# Altium project EFR32xG1x_DISC_REF_DES_A00.PrjPcb
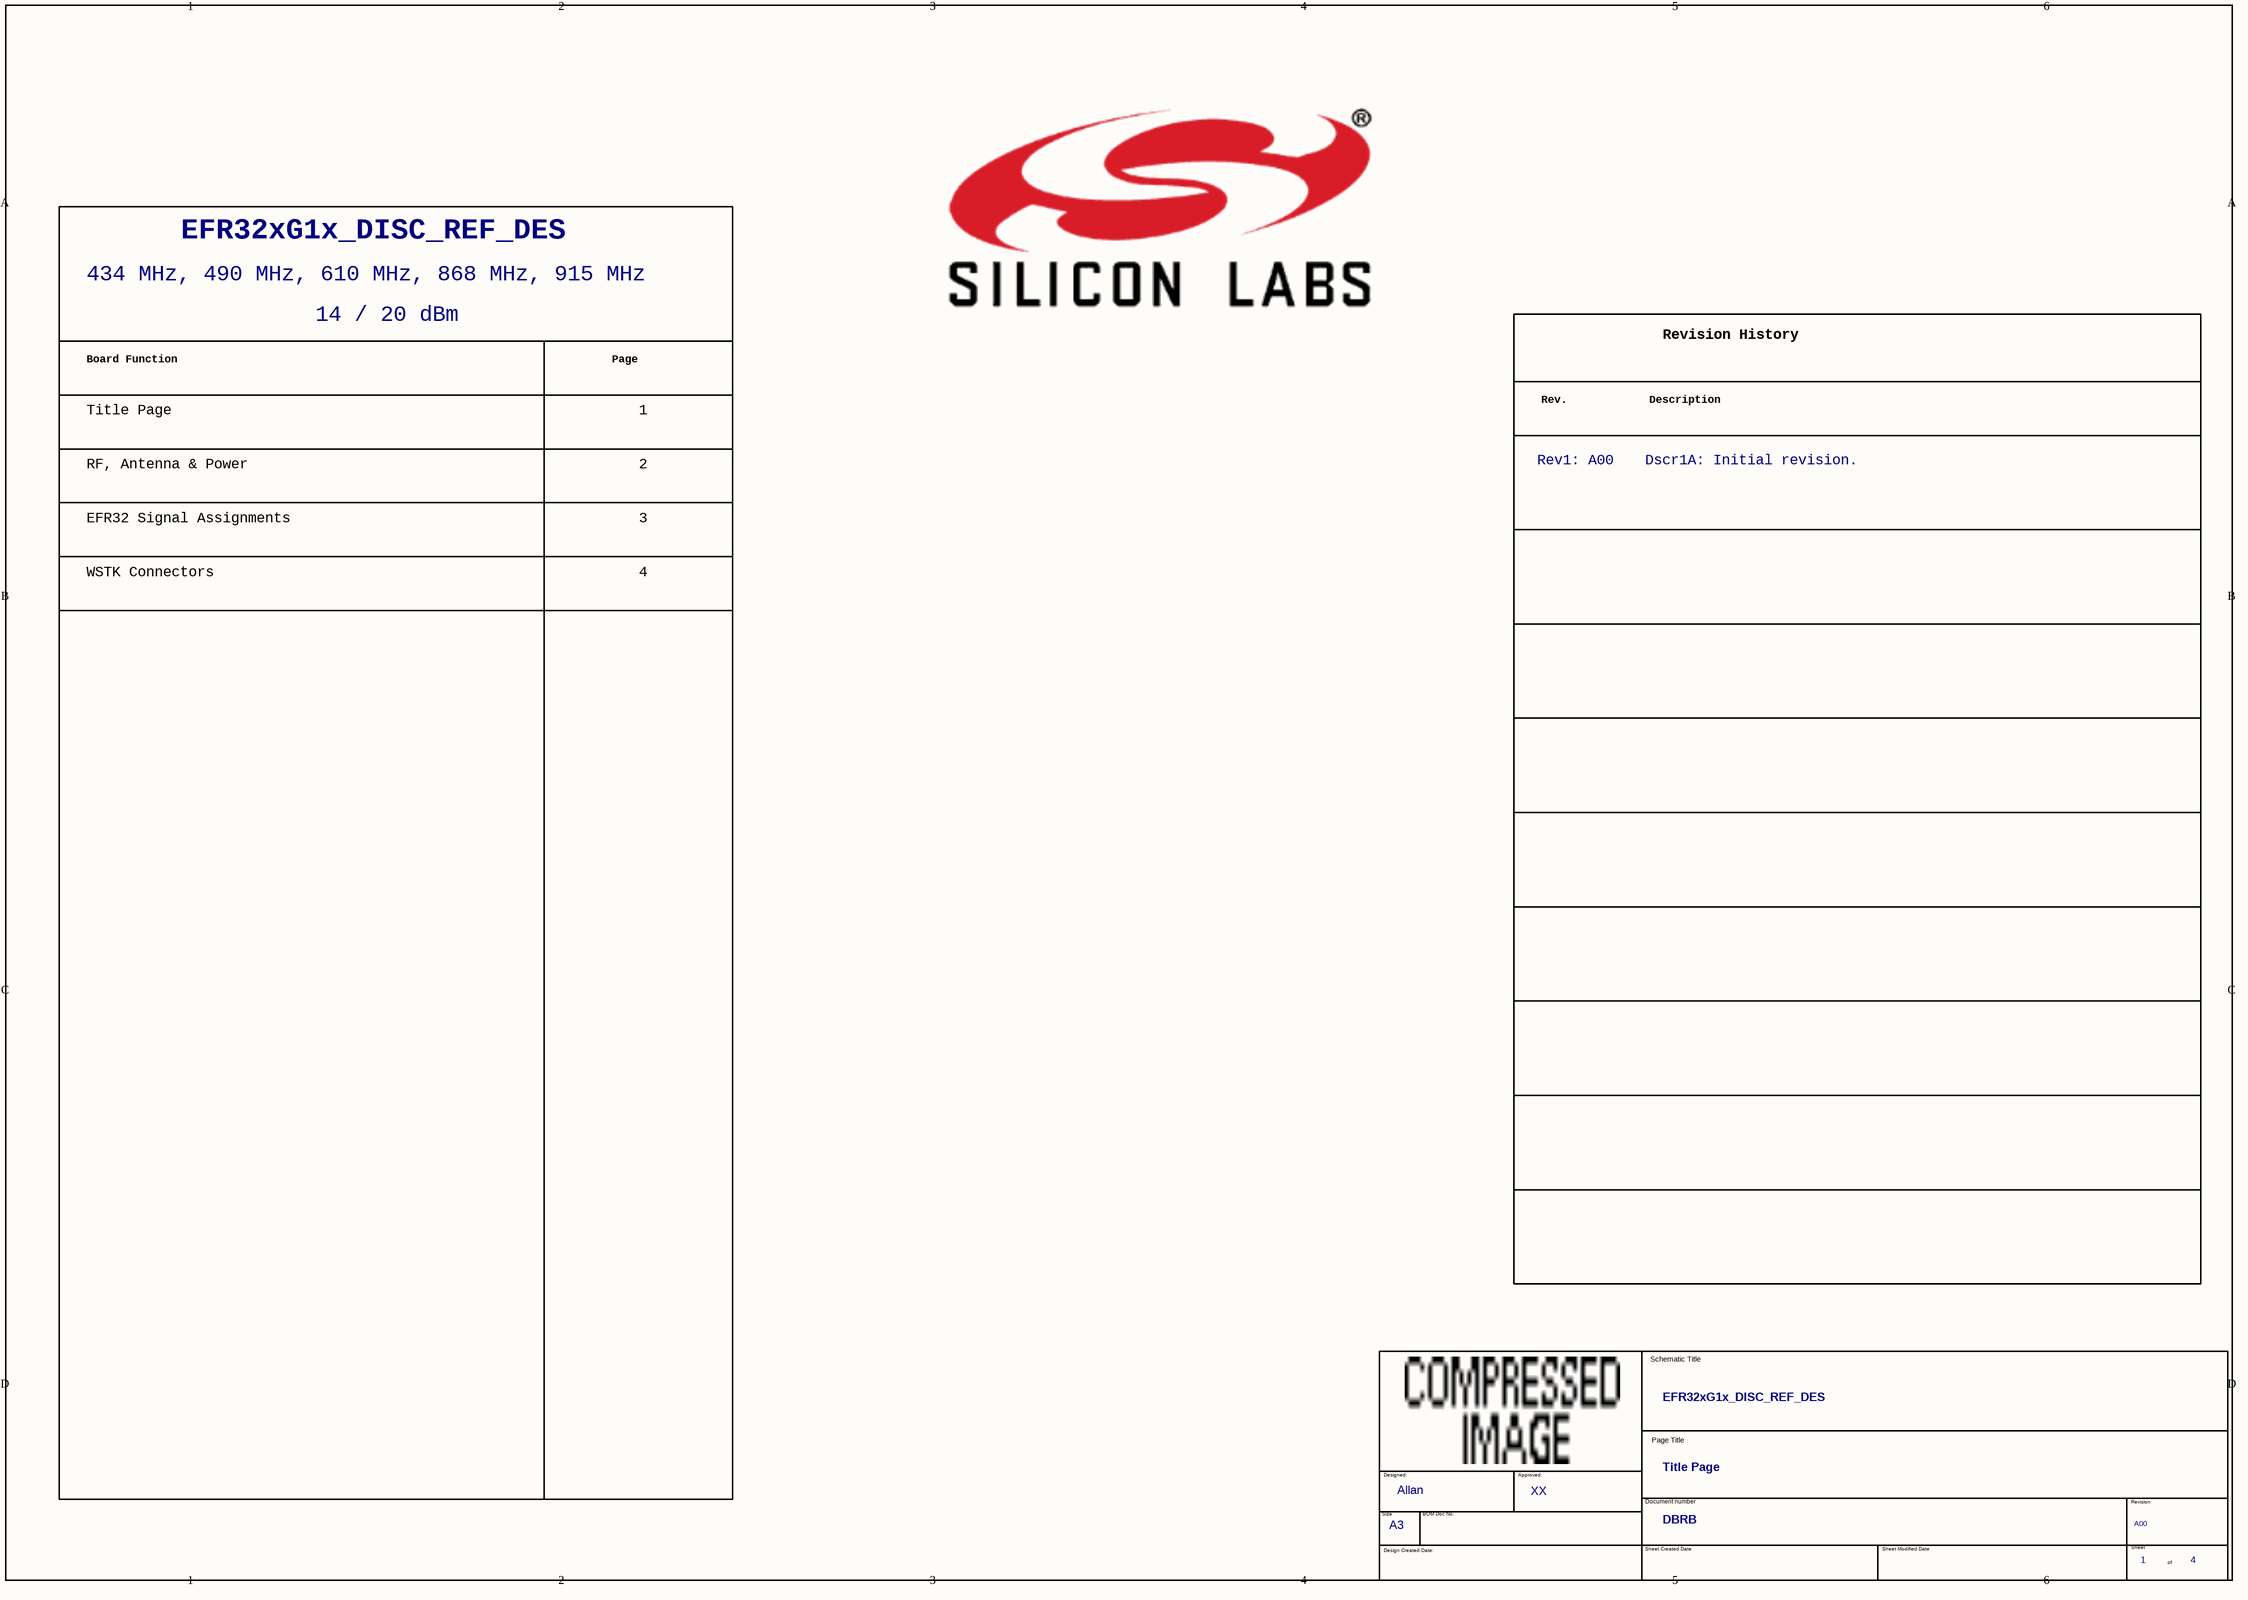
[diagram p0: 01_EFR32xG1x_DISC_REF_DES_A00_TitlePage.SchDoc]
4 sheets, 94 parts. Net scope: global (net labels, ports and power ports of the same name join across sheets).
Board file: EFR32xG1x_DISC_REF_DES_A00.PcbDoc
Sheets:
  01_EFR32xG1x_DISC_REF_DES_A00_TitlePage.SchDoc
  02_EFR32xG1x_DISC_REF_DES_A00_RfAntPower.SchDoc
  03_EFR32xG1x_DISC_REF_DES_A00_Efr32Signal.SchDoc
  04_EFR32xG1x_DISC_REF_DES_A00_Conn.SchDoc

## Sheet 01_EFR32xG1x_DISC_REF_DES_A00_TitlePage.SchDoc
size 420 x 297 mm

### Parts
(Parts that share a designator on the sheet are numbered #1, #2 ... from top to bottom, then left to right.)
*#1  Header A: EFR32xG1x_DISC_REF_DES  (hidden comment: Toc_Header)  (graphical)
*#2  Dscr1A: Initial revision.  Rev1: A00  (hidden comment: Rev_History)  (graphical)
*#3  OrgAddr2: XX  OrgAddr1: Allan  Page Count: 4  Page Number: 1  Doc: DBRB  Title: EFR32xG1x_DISC_REF_DES  RevCode: A00  Page Size: A3  Page Title: Title Page  (hidden comment: TitleBlock_EnergyMicro_A3)  (graphical)

### Notes on the sheet
- 434 MHz, 490 MHz, 610 MHz, 868 MHz, 915 MHz
- 14 / 20 dBm
- Board Function
- Page
- Title Page
- 1
- EFR32 Signal Assignments
- RF, Antenna & Power
- 2
- 3
- WSTK Connectors
- 4
- (in symbol Rev_History) Revision History; Rev.; Description
- (in symbol TitleBlock_EnergyMicro_A3) Schematic Title; Page Title; Designed:; Approved:; Document number; Revision; Size; BOM Doc No:; Design Created Date:; Sheet Created Date; Sheet Modified Date; Sheet; of

### Library data of the parts
*#1 = Toc_Header: Doc: BRD4259A; Page Count: 5; Page Number: 1; OrgName: Silicon Labs; RevCode: A01
*#2 = Rev_History: Doc: BRD4259A; RevCode: A01; Title: EFR32FG14 2.4 GHz / 434 MHz 10 dBm Radio Board; OrgAddr2: JNO; OrgAddr1: JSH; OrgName: Silicon Labs; Page Number: 1; Page Count: 5

## Sheet 02_EFR32xG1x_DISC_REF_DES_A00_RfAntPower.SchDoc
size 420 x 297 mm
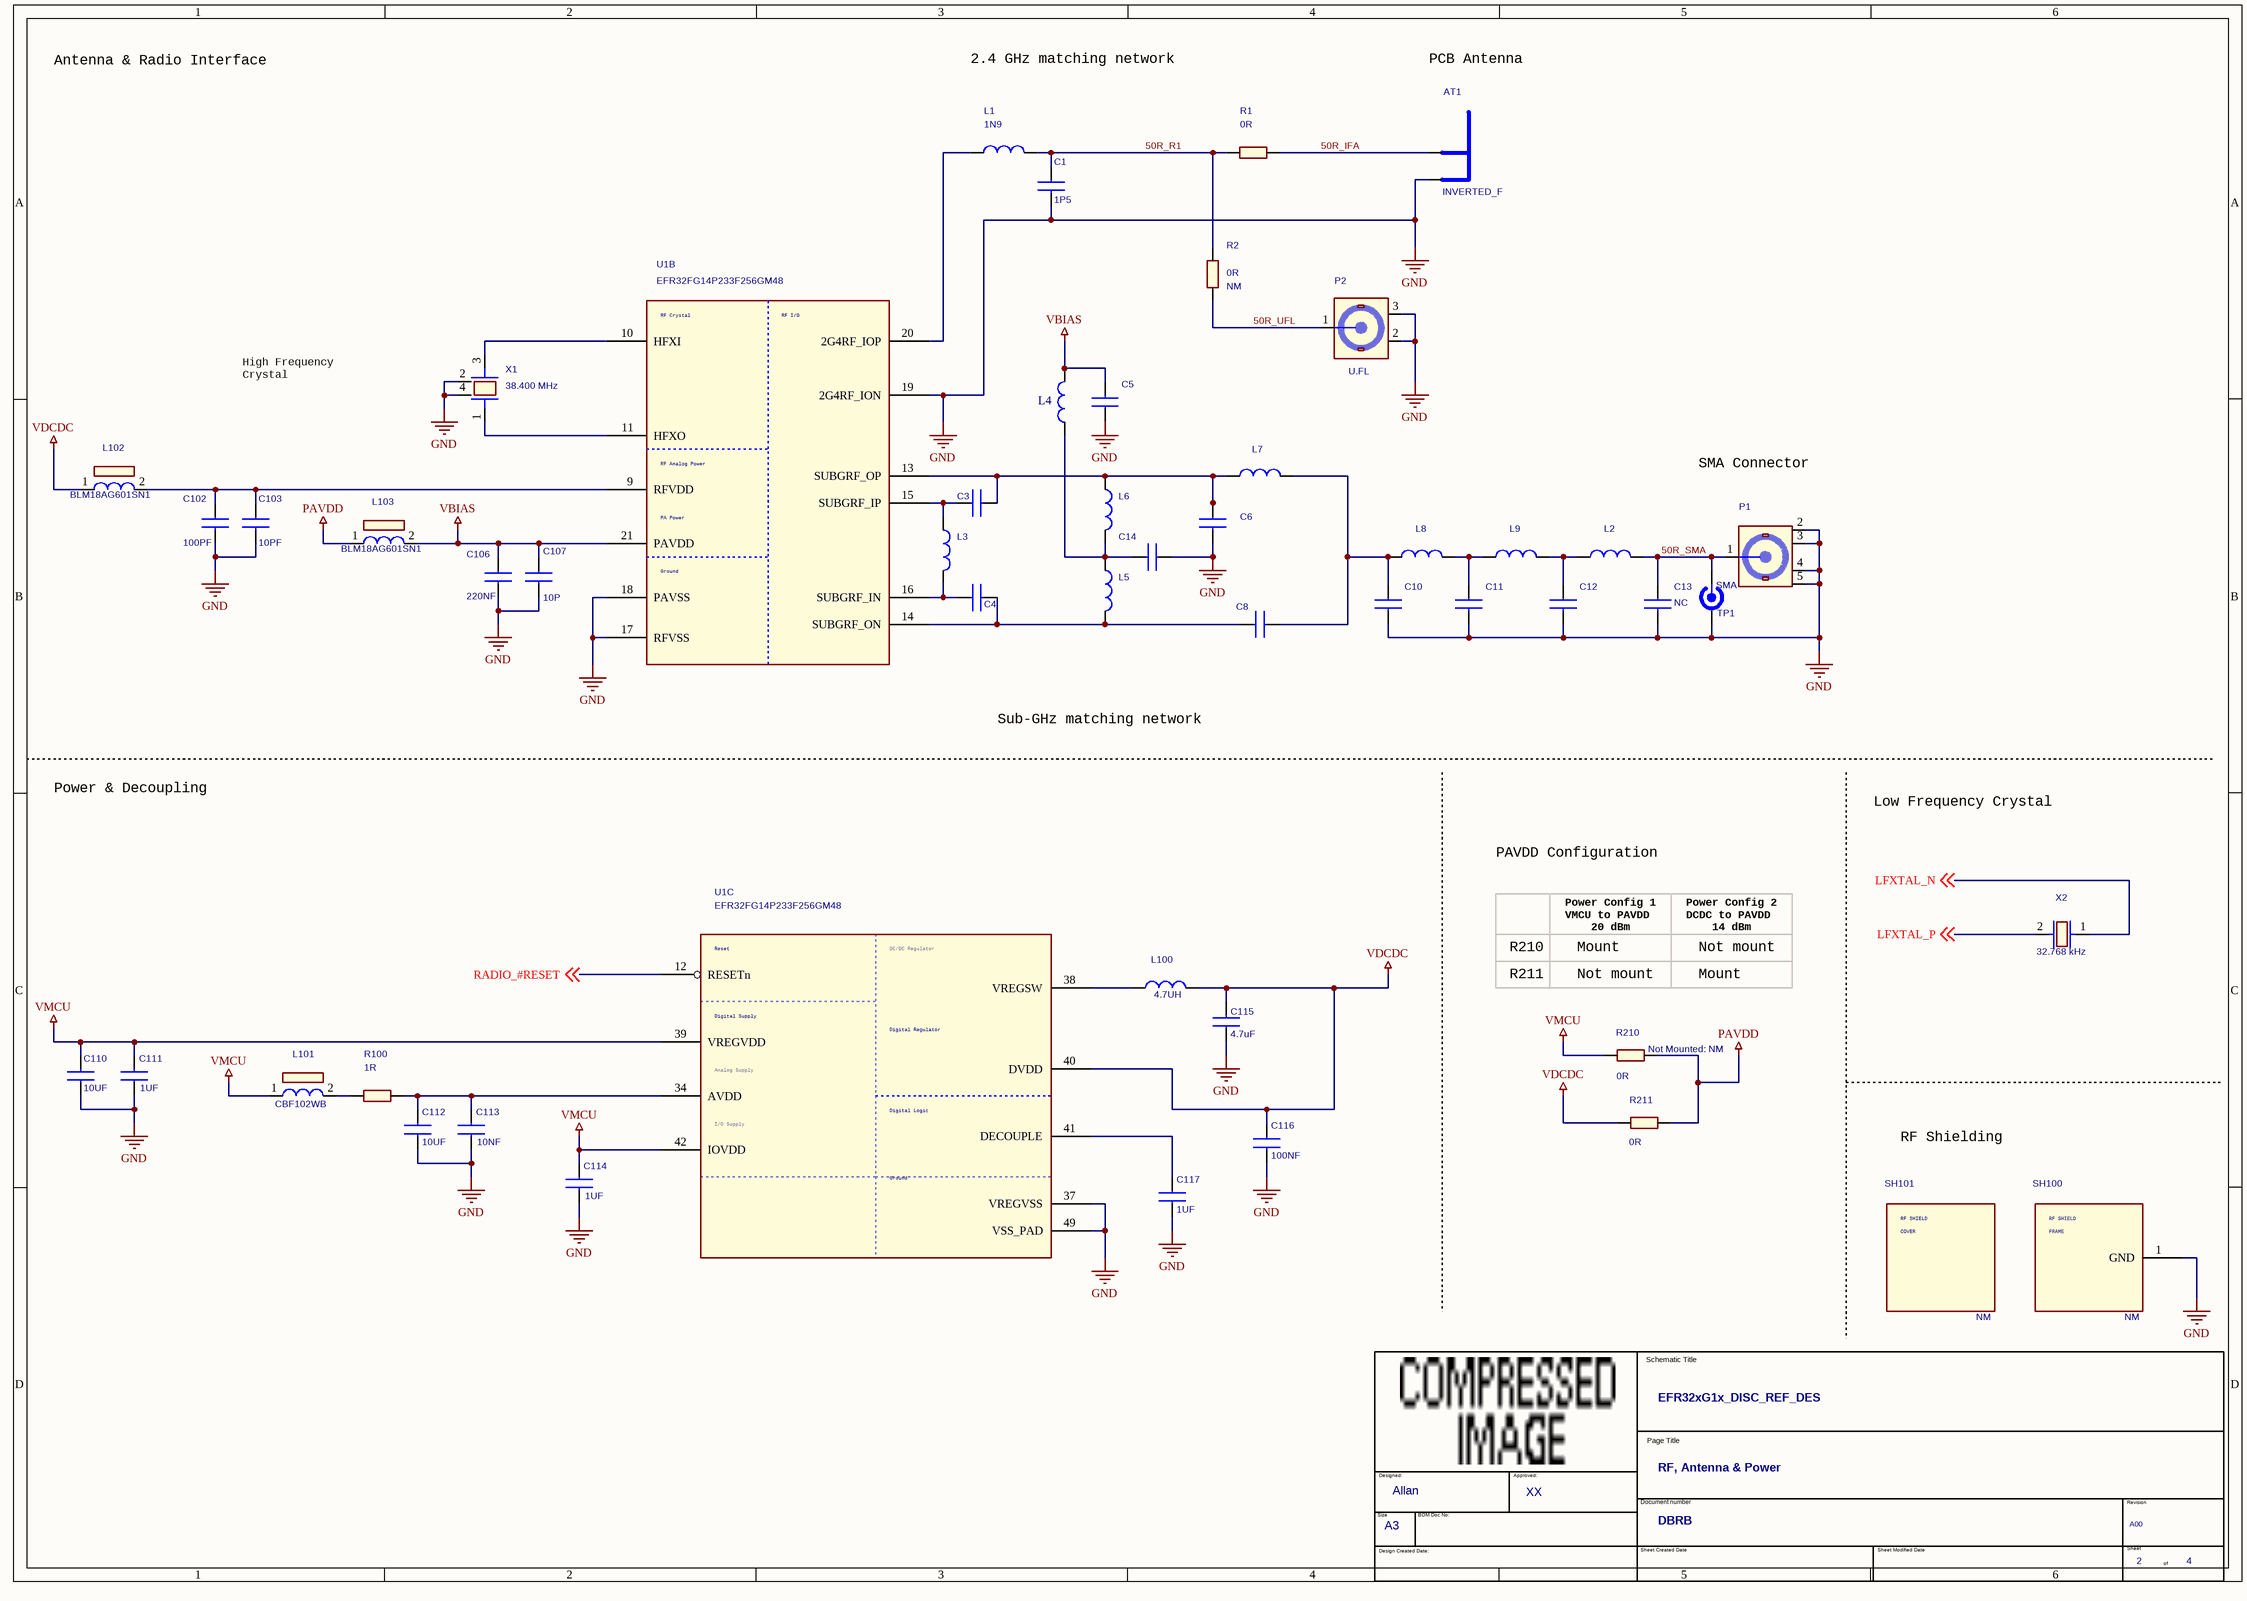
[diagram p1: 02_EFR32xG1x_DISC_REF_DES_A00_RfAntPower.SchDoc]

### Parts
(Parts that share a designator on the sheet are numbered #1, #2 ... from top to bottom, then left to right.)
*#4  OrgAddr2: XX  OrgAddr1: Allan  Page Count: 4  Page Number: 2  Doc: DBRB  Title: EFR32xG1x_DISC_REF_DES  RevCode: A00  Page Size: A3  Page Title: RF, Antenna & Power  (hidden comment: TitleBlock_EnergyMicro_A3)  (graphical)
AT1  INVERTED_F  [ANT_INV_F_2.4_GHZ_17.3MM_MIR]
C1  1P5  [C0201_L]
C3  1P8  [C0201_L]  (value not drawn)
C4  1P8  [C0201_L]  (value not drawn)
C5  270pF  [C0201_L]  (value not drawn)
C6  5.1P  [C0201_L]  (value not drawn)
C8  4P7  [C0201_L]  (value not drawn)
C10  6P2  [C0201_L]  (value not drawn)
C11  5.6P  [C0201_L]  (value not drawn)
C12  5P6  [C0201_L]  (value not drawn)
C13  NC  [C0201_L]
C14  2P  [C0201_L]  (value not drawn)
C102  100PF  [C0402_L]
C103  10PF  [C0402_L]
C106  220NF  [C0402_L]
C107  10P  [C0201_L]
C110  10UF  [C0603_L]
C111  1UF  [C0402_L]
C112  10UF  [C0603_L]
C113  10NF  [C0402_L]
C114  1UF  [C0402_L]
C115  4.7uF  [C0402_L]
C116  100NF  [C0402_L]
C117  1UF  [C0402_L]
L1  1N9  [COIL_0201_L]
L2  120P  [COIL_0201_L]  (value not drawn)
L3  75NH  [COIL_0201_L]  (value not drawn)
L4  330NH  [COIL_0402_L]  (value not drawn)
L5  12NH  [COIL_0201_L]  (value not drawn)
L6  12NH  [COIL_0201_L]  (value not drawn)
L7  27NH  [COIL_0201_L]  (value not drawn)
L8  24NH  [COIL_0201_L]  (value not drawn)
L9  24NH  [COIL_0201_L]  (value not drawn)
L100  4.7UH  [COIL_MUR_LQH3NP_1212]
L101  CBF102WB  [WURTH_CBF_0603]
L102  BLM18AG601SN1  [COIL_MUR_BLM18_0603]
L103  BLM18AG601SN1  [COIL_MUR_BLM18_0603]
P1  SMA  [TE_SMA_TH_1814832]
P2  U.FL  [HIROSE_U.FL-R-SMT-1]
R1  0R  [R0402_L]
R2  0R  Not Mounted: NM  [R0402_L]
R100  1R  [R0402_L]
R210  0R  Not Mounted: NM  [R0402_L]
R211  0R  [R0402_L]
SH100  Not Mounted: NM  [RF_SHIELD_FRAME_BMI-S-203-F_PCB4100]  (hidden comment: RF_SHIELD_FRAME_BMI-S-203-F)
SH101  Not Mounted: NM  (hidden comment: RF_SHIELD_COVER_BMI-S-203-C)
TP1  RF_TEST_POINT  [TP_INGUN_50_OHM_CLOSED openvia]  (value not drawn)
U1  EFR32FG14P233F256GM48  [QFN48_M050_SQ7.0_EP_SL_L]  (parts B,C of 3)
X1  38.400 MHz  [X_SSS_DSX211SH_2.05X1.65-4]
X2  32.768 kHz  [X_MCS_CM8V-T1A]

### Nets
GND: AT1.2(GND) C1.1 C5.2 C6.2 C10.2 C11.2 C12.2 C13.2 C14.2 C102.2 C103.2 C106.2 C107.2 C110.2 C111.2 C112.2 C113.2 C114.2 C115.2 C116.2 C117.2 P1.2(GND1) P1.3(GND2) P1.4(GND3) P1.5(GND4) P2.2(GND1) P2.3(GND4) SH100.1(GND) TP1.2(GND) U1.17(RFVSS) U1.18(PAVSS) U1.19(2G4RF_ION) U1.37(VREGVSS) U1.49(VSS_PAD) X1.2 X1.4
PAVDD: L103.1 R210.1 R211.1
VBIAS: C5.1 C106.1 C107.1 L4.1 L103.2 U1.21(PAVDD)
VDCDC: C115.1 C116.1 L100.2 L102.1 R211.2 U1.40(DVDD)
VMCU: C110.1 C111.1 C114.1 L101.1 R210.2 U1.39(VREGVDD) U1.42(IOVDD)
50R_IFA: AT1.1(ANT) R1.2
50R_R1: C1.2 L1.2 R1.1 R2.1
50R_SMA: C13.1 L2.1 P1.1(SIGNAL) TP1.1(RF)
50R_UFL: P2.1(SIGNAL) R2.2
LFXTAL_N: X2.1 ; off-sheet LFXTAL_N  [project net RADIO_PB15]
LFXTAL_P: X2.2 ; off-sheet LFXTAL_P  [project net RADIO_PB14]
RADIO_#RESET: U1.12(RESETn) ; off-sheet RADIO_#RESET  [project net DEBUG.RESET]
NetC3_1: C3.1 C6.1 L6.1 L7.2 U1.13(SUBGRF_OP)
NetC3_2: C3.2 L3.1 U1.15(SUBGRF_IP)
NetC4_1: C4.1 C8.2 L5.2 U1.14(SUBGRF_ON)
NetC4_2: C4.2 L3.2 U1.16(SUBGRF_IN)
NetC8_1: C8.1 C10.1 L7.1 L8.2
NetC11_1: C11.1 L8.1 L9.2
NetC12_1: C12.1 L2.2 L9.1
NetC14_1: C14.1 L4.2 L5.1 L6.2
NetC102_1: C102.1 C103.1 L102.2 U1.9(RFVDD)
NetC112_1: C112.1 C113.1 R100.2 U1.34(AVDD)
NetC117_1: C117.1 U1.41(DECOUPLE)
NetL1_1: L1.1 U1.20(2G4RF_IOP)
NetL100_1: L100.1 U1.38(VREGSW)
NetL101_2: L101.2 R100.1
NetU1_10: U1.10(HFXI) X1.3
NetU1_11: U1.11(HFXO) X1.1

### Notes on the sheet
- Antenna & Radio Interface
- 2.4 GHz matching network
- PCB Antenna
- High Frequency
  Crystal
- SMA Connector
- Sub-GHz matching network
- Power & Decoupling
- PAVDD Configuration
- Low Frequency Crystal
- Power Config 1
  VMCU to PAVDD
  20 dBm
- Power Config 2
  DCDC to PAVDD
  14 dBm
- R210
- R211
- Not mount
- Mount
- RF Shielding
- (in symbol EFR32-DUALBAND-QFN48, part B) RF Crystal; RF I/O; RF Analog Power; PA Power; Ground
- (in symbol EFR32-DUALBAND-QFN48, part C) Reset; DC/DC Regulator; Digital Supply; Digital Regulator; Analog Supply; Digital Logic; I/O Supply; Ground
- (in symbol RF_SHIELD_COVER_BMI-S-203-C) RF SHIELD; COVER
- (in symbol RF_SHIELD_FRAME_BMI-S-203-F) RF SHIELD; FRAME
- (in symbol TitleBlock_EnergyMicro_A3) Schematic Title; Page Title; Designed:; Approved:; Document number; Revision; Size; BOM Doc No:; Design Created Date:; Sheet Created Date; Sheet Modified Date; Sheet; of

### Library data of the parts
AT1 = ANT_INVERTED_F
C1 = C0402: Tolerance: ?.05P; Mfg: Murata; Mfg #: GRM1555C1H1R5WA01D; Technology: C0G
C3 C4 = C0402: Tolerance: ?.05P; Mfg: Murata; Mfg #: GRM1555C1H1R6WA01D; Technology: C0G
C5 C10 = C0402: Tolerance: ?.1P; Mfg: Murata; Mfg #: GRM1555C1H6R2BA01D; Technology: C0G
C6 = C0402
C8 C14 = C0402: Tolerance: ?%; Mfg: Murata; Mfg #: GRM1555C1H271FA01D; Technology: C0G
C11 = C0402: Tolerance: ?%; Mfg: Murata; Mfg #: GRM1555C1H110GA01D; Technology: C0G
C12 C13 = C0402: Tolerance: ?.05pF; Mfg: Murata; Mfg #: GRM1555C1H5R6WA01D; Technology: C0G
C102 C103 C107 = C0402: Rating: 50V; Tolerance: 5%; Technology: C0G
C106 C113 C116 = C0402: Rating: 16V; Tolerance: 10%; Technology: X7R
C110 C112 = C0603: Rating: 6.3V; Tolerance: 20%; Technology: X5R
C111 C114 C117 = C0402: Rating: 25V; Tolerance: 10%; Technology: X5R
C115 = C0402: Rating: 6.3V; Tolerance: 10%; Technology: X5R
L1 = L0402: Mfg: Murata; Mfg #: LQP15MN1N9W02D; Tolerance: ?.05N
L2 L8 L9 = L0402: Mfg: Murata; Mfg #: LQW15AN24NG00D; Tolerance: ?%
L3 L5 L6 = L0402
L4 = L0603
L7 = L0402: Mfg: Murata; Mfg #: LQW15AN18NG00D; Tolerance: ?%
L100 = LQH3NP: Mfg: Murata; Mfg #: LQH3NPN4R7MM0L
L101 = CBF102WB: Mfg: W黵th Electronics; Mfg #: 74279266; Price_1K: 0.031
L102 L103 = BLM18AG: Mfg: Murata; Mfg #: BLM18AG601SN1D; Price_1K: 0.027
P1 = SMA_TH: Mfg #: 5-1814832-1; Mfg: TE Connectivity; Price_1K: 1.46
P2 = HIROSE_U.FL: Mfg: Hirose; Mfg #: U.FL-R-SMT-1; Price_1K: 0.70
R1 R2 R100 R210 R211 = R0402: Price_1K: 0.005
SH100 = RF_SHIELD_FRAME_BMI-S-203-F: Mfg: Laird Technologies; Price_1k: 1.148; Mfg #: BMI-S-203-F; Footprint: Laird_BMI-S-203-F
SH101 = RF_SHIELD_COVER_BMI-S-203-C: Mfg: Laird Technologies; Mfg #: BMI-S-203-C; Price_1k: 0.814
TP1 = TP_RF
U1 = EFR32-DUALBAND-QFN48: MFG: Silicon Labs; MFG #: EFR32FG14P233F256GM48-BR
X1 = DSX211SH: Mfg: KDS; Mfg #: DSX211SH 1ZZNAE38400AB0A; Price_1K: 0.512
X2 = CM8V-T1A: Mfg: KDS; Mfg #: DST210 1TJG125DP1A0012; Price_1K: 0.3

## Sheet 03_EFR32xG1x_DISC_REF_DES_A00_Efr32Signal.SchDoc
size 420 x 297 mm
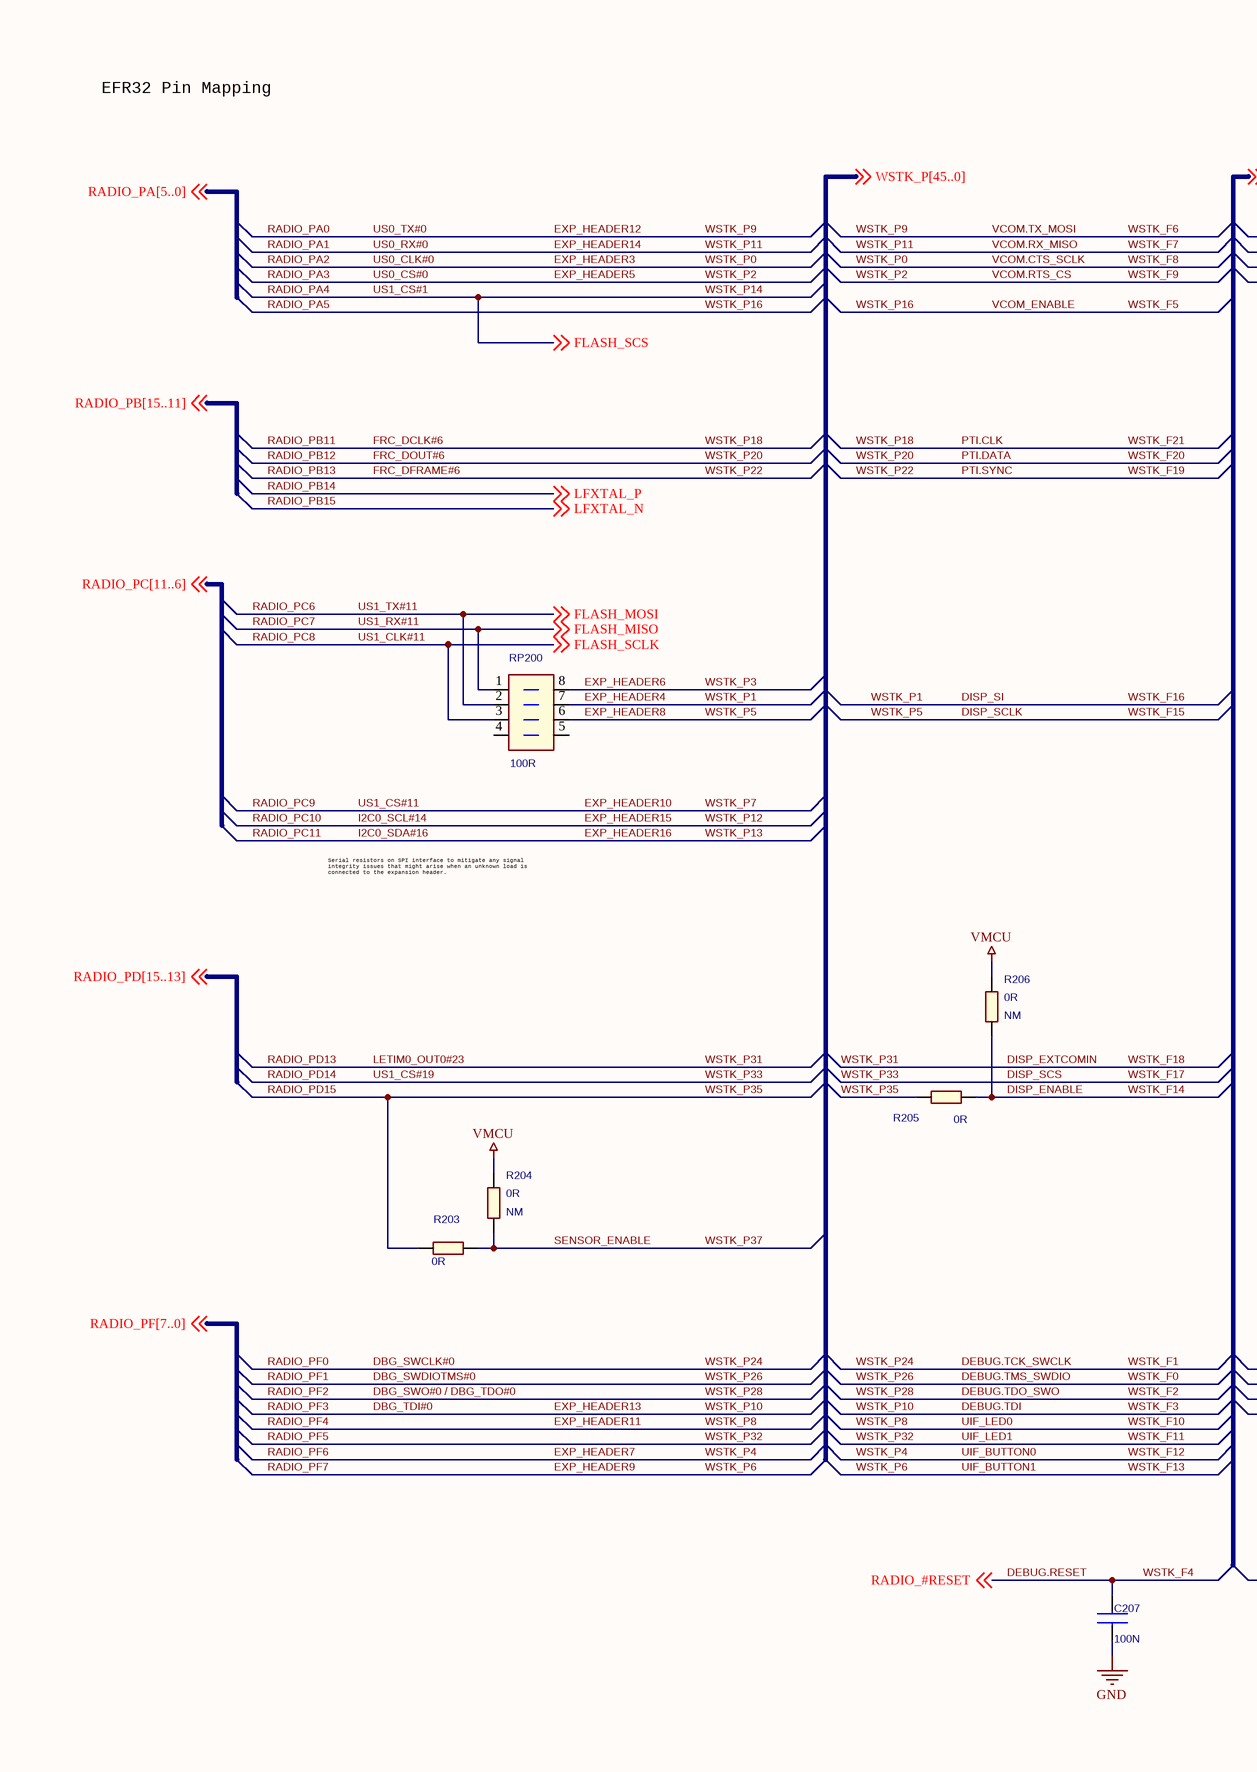
[diagram p2: 03_EFR32xG1x_DISC_REF_DES_A00_Efr32Signal.SchDoc, left]
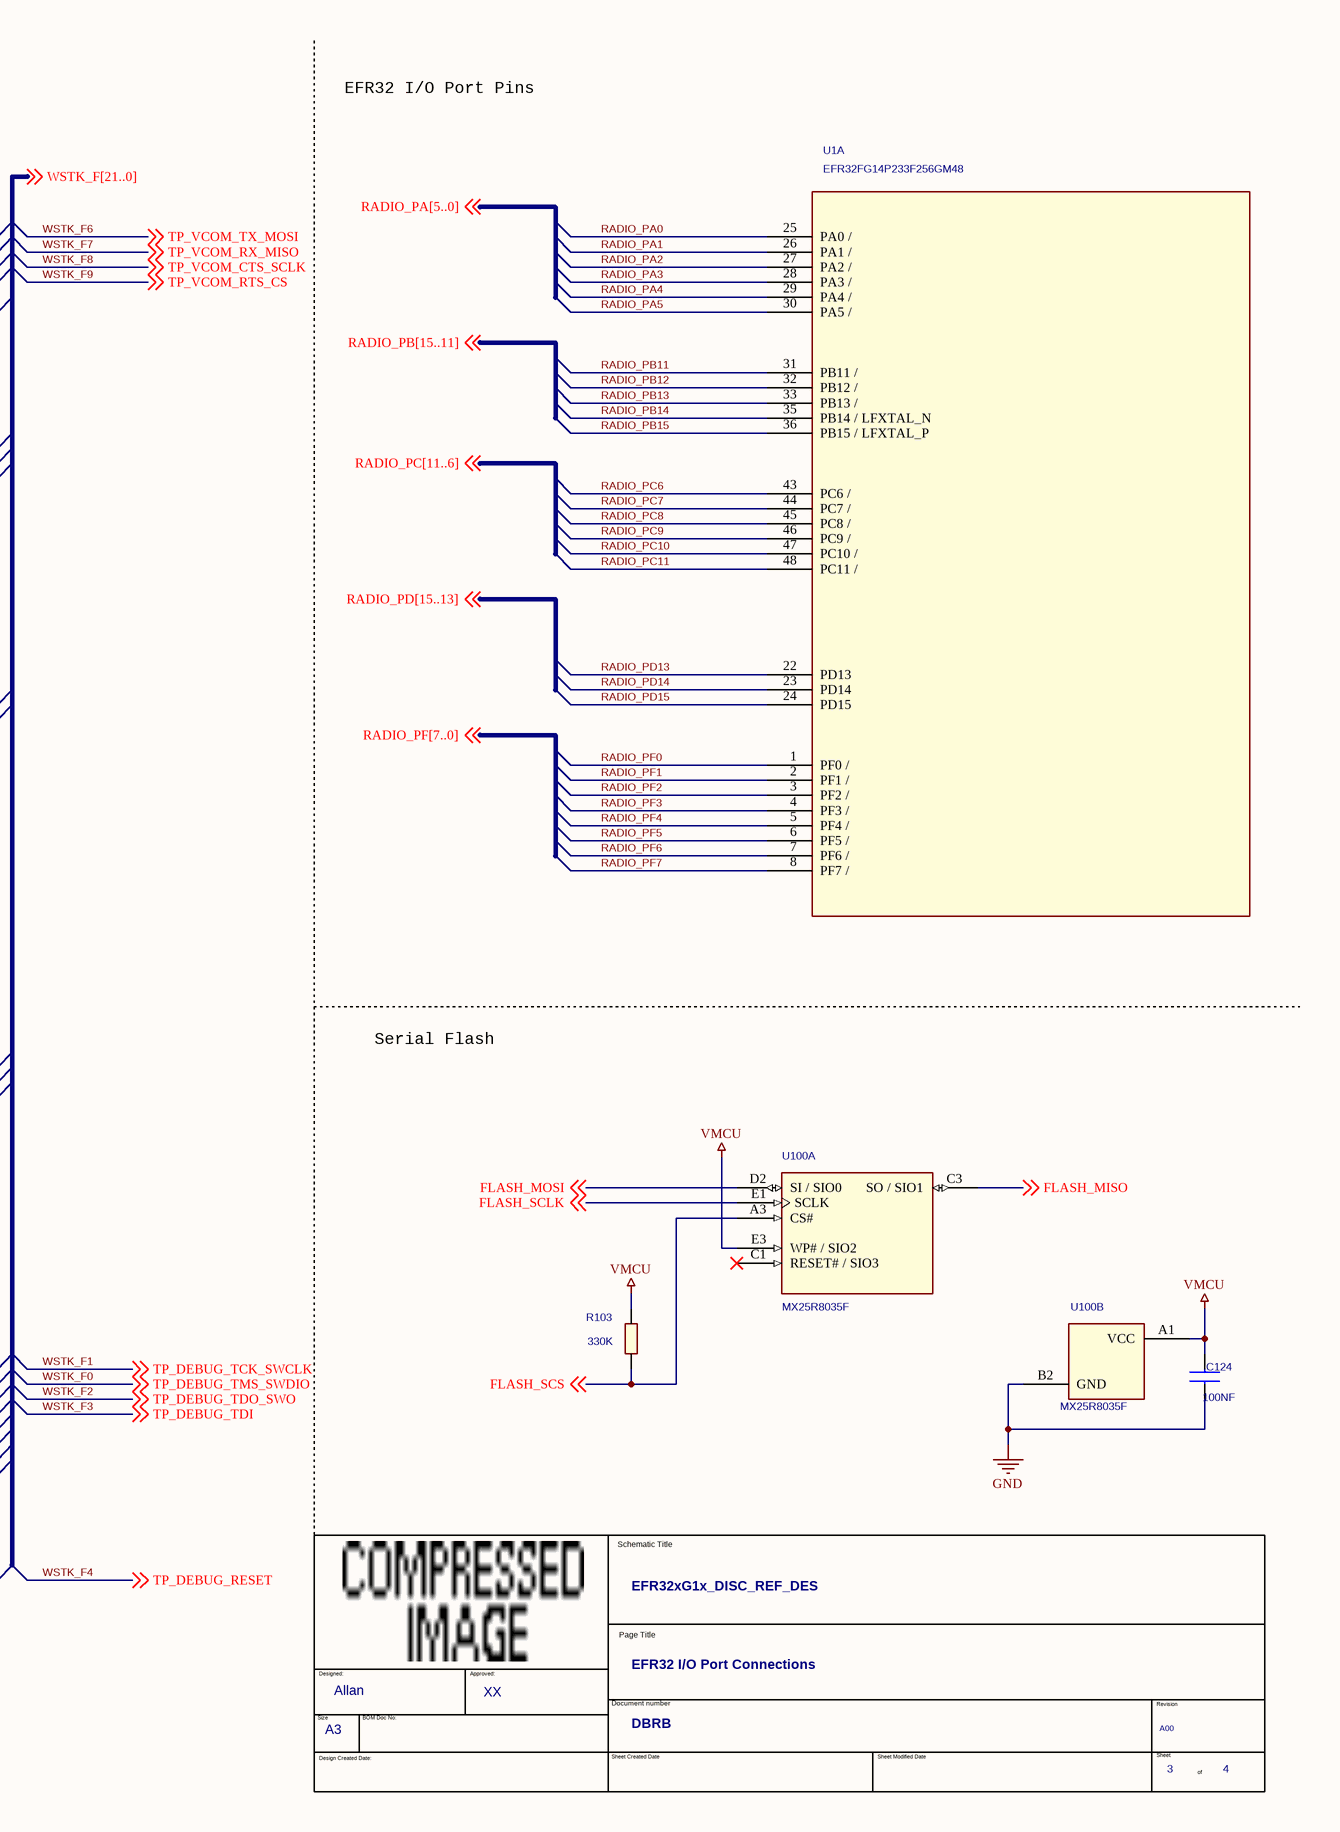
[diagram p3: 03_EFR32xG1x_DISC_REF_DES_A00_Efr32Signal.SchDoc, right]

### Parts
(Parts that share a designator on the sheet are numbered #1, #2 ... from top to bottom, then left to right.)
*#5  OrgAddr2: XX  OrgAddr1: Allan  Page Count: 4  Page Number: 3  Doc: DBRB  Title: EFR32xG1x_DISC_REF_DES  RevCode: A00  Page Size: A3  Page Title: EFR32 I/O Port Connections  (hidden comment: TitleBlock_EnergyMicro_A3)  (graphical)
C124  100NF  [C0402_L]
C207  100N  [C0402_L]
R103  330K  [R0402_L]
R203  0R  [R0402_L]
R204  0R  Not Mounted: NM  [R0402_L]
R205  0R  [R0402_L]
R206  0R  Not Mounted: NM  [R0402_L]
RP200  100R  [RES_MNR04-8]
U1  EFR32FG14P233F256GM48  [QFN48_M050_SQ7.0_EP_SL_L]  (part A of 3)
U100  MX25R8035F  [BGA8_M040_1.24x1.75_WLCSP]  (parts A,B of 2)

### Nets
GND: C124.2 C207.2 U100.B2(GND)
VMCU: C124.1 R103.1 R204.1 R206.1 U100.A1(VCC) U100.E3(WP#_/_SIO2)
DBG_SWCLK#0: U1.1(PF0_/) ; off-sheet TP_DEBUG_TCK_SWCLK  [also labelled DEBUG.TCK_SWCLK, RADIO_PF0, TP_DEBUG_TCK_SWCLK, WSTK_F1, WSTK_P24]
DBG_SWDIOTMS#0: U1.2(PF1_/) ; off-sheet TP_DEBUG_TMS_SWDIO  [also labelled DEBUG.TMS_SWDIO, RADIO_PF1, TP_DEBUG_TMS_SWDIO, WSTK_F0, WSTK_P26]
DBG_SWO#0 / DBG_TDO#0: U1.3(PF2_/) ; off-sheet TP_DEBUG_TDO_SWO  [also labelled DEBUG.TDO_SWO, RADIO_PF2, TP_DEBUG_TDO_SWO, WSTK_F2, WSTK_P28]
DBG_TDI#0: U1.4(PF3_/) ; off-sheet TP_DEBUG_TDI  [also labelled DEBUG.TDI, EXP_HEADER13, RADIO_PF3, TP_DEBUG_TDI, WSTK_F3, WSTK_P10]
DEBUG.RESET: C207.1 ; off-sheet RADIO_#RESET, off-sheet TP_DEBUG_RESET  [also labelled RADIO_#RESET, TP_DEBUG_RESET, WSTK_F4]
DISP_ENABLE: R205.2 R206.2  [also labelled WSTK_F14]
DISP_EXTCOMIN: U1.22(PD13)  [also labelled LETIM0_OUT0#23, RADIO_PD13, WSTK_F18, WSTK_P31]
DISP_SCLK: RP200.6(R16)  [also labelled EXP_HEADER8, WSTK_F15, WSTK_P5]
DISP_SCS: U1.23(PD14)  [also labelled RADIO_PD14, US1_CS#19, WSTK_F17, WSTK_P33]
DISP_SI: RP200.7(R17)  [also labelled EXP_HEADER4, WSTK_F16, WSTK_P1]
EXP_HEADER3: U1.27(PA2_/) ; off-sheet TP_VCOM_CTS_SCLK  [also labelled RADIO_PA2, TP_VCOM_CTS_SCLK, US0_CLK#0, VCOM.CTS_SCLK, WSTK_F8, WSTK_P0]
EXP_HEADER5: U1.28(PA3_/) ; off-sheet TP_VCOM_RTS_CS  [also labelled RADIO_PA3, TP_VCOM_RTS_CS, US0_CS#0, VCOM.RTS_CS, WSTK_F9, WSTK_P2]
EXP_HEADER6: RP200.8(R18)  [also labelled WSTK_P3]
EXP_HEADER7: U1.7(PF6_/)  [also labelled RADIO_PF6, UIF_BUTTON0, WSTK_F12, WSTK_P4]
EXP_HEADER9: U1.8(PF7_/)  [also labelled RADIO_PF7, UIF_BUTTON1, WSTK_F13, WSTK_P6]
EXP_HEADER10: U1.46(PC9_/)  [also labelled RADIO_PC9, US1_CS#11, WSTK_P7]
EXP_HEADER11: U1.5(PF4_/)  [also labelled RADIO_PF4, UIF_LED0, WSTK_F10, WSTK_P8]
EXP_HEADER12: U1.25(PA0_/) ; off-sheet TP_VCOM_TX_MOSI  [also labelled RADIO_PA0, TP_VCOM_TX_MOSI, US0_TX#0, VCOM.TX_MOSI, WSTK_F6, WSTK_P9]
EXP_HEADER14: U1.26(PA1_/) ; off-sheet TP_VCOM_RX_MISO  [also labelled RADIO_PA1, TP_VCOM_RX_MISO, US0_RX#0, VCOM.RX_MISO, WSTK_F7, WSTK_P11]
EXP_HEADER15: U1.47(PC10_/)  [also labelled I2C0_SCL#14, RADIO_PC10, WSTK_P12]
EXP_HEADER16: U1.48(PC11_/)  [also labelled I2C0_SDA#16, RADIO_PC11, WSTK_P13]
FRC_DCLK#6: U1.31(PB11_/)  [also labelled PTI.CLK, RADIO_PB11, WSTK_F21, WSTK_P18]
FRC_DFRAME#6: U1.33(PB13_/)  [also labelled PTI.SYNC, RADIO_PB13, WSTK_F19, WSTK_P22]
FRC_DOUT#6: U1.32(PB12_/)  [also labelled PTI.DATA, RADIO_PB12, WSTK_F20, WSTK_P20]
RADIO_PA4: R103.2 U1.29(PA4_/) U100.A3(CS#) ; off-sheet FLASH_SCS  [also labelled FLASH_SCS, US1_CS#1, WSTK_P14]
RADIO_PA5: U1.30(PA5_/)  [also labelled VCOM_ENABLE, WSTK_F5, WSTK_P16]
RADIO_PB14: U1.35(PB14_/_LFXTAL_N) ; off-sheet LFXTAL_P  [also labelled LFXTAL_P]
RADIO_PB15: U1.36(PB15_/_LFXTAL_P) ; off-sheet LFXTAL_N  [also labelled LFXTAL_N]
RADIO_PC6: RP200.2(R12) U1.43(PC6_/) U100.D2(SI_/_SIO0) ; off-sheet FLASH_MOSI  [also labelled FLASH_MOSI, US1_TX#11]
RADIO_PC7: RP200.1(R11) U1.44(PC7_/) U100.C3(SO_/_SIO1) ; off-sheet FLASH_MISO  [also labelled FLASH_MISO, US1_RX#11]
RADIO_PC8: RP200.3(R13) U1.45(PC8_/) U100.E1(SCLK) ; off-sheet FLASH_SCLK  [also labelled FLASH_SCLK, US1_CLK#11]
RADIO_PD15: R203.1 R205.1 U1.24(PD15)  [also labelled WSTK_P35]
RADIO_PF5: U1.6(PF5_/)  [also labelled UIF_LED1, WSTK_F11, WSTK_P32]
SENSOR_ENABLE: R203.2 R204.2  [also labelled WSTK_P37]

Not connected (* = marked no-connect by the designer): RP200 4(R14) 5(R15); U100 C1(RESET#_/_SIO3)*

### Notes on the sheet
- EFR32 Pin Mapping
- EFR32 I/O Port Pins
- Serial resistors on SPI interface to mitigate any signal
  integrity issues that might arise when an unknown load is
  connected to the expansion header.
- Serial Flash
- (in symbol TitleBlock_EnergyMicro_A3) Schematic Title; Page Title; Designed:; Approved:; Document number; Revision; Size; BOM Doc No:; Design Created Date:; Sheet Created Date; Sheet Modified Date; Sheet; of

### Library data of the parts
C124 C207 = C0402: Rating: 16V; Tolerance: 10%; Technology: X7R
R103 R203-R206 = R0402: Price_1K: 0.005
RP200 = MNR04M0APJ101: Mfg: ROHM; Mfg #: MNR04M0APJ101; Price_1K: 0.0122
U1 = EFR32-DUALBAND-QFN48: as U1 on sheet 02_EFR32xG1x_DISC_REF_DES_A00_RfAntPower
U100 = MX25R8035: Mfg: Macronix; Mfg #: MX25R8035FBDIL0

## Sheet 04_EFR32xG1x_DISC_REF_DES_A00_Conn.SchDoc
size 420 x 297 mm
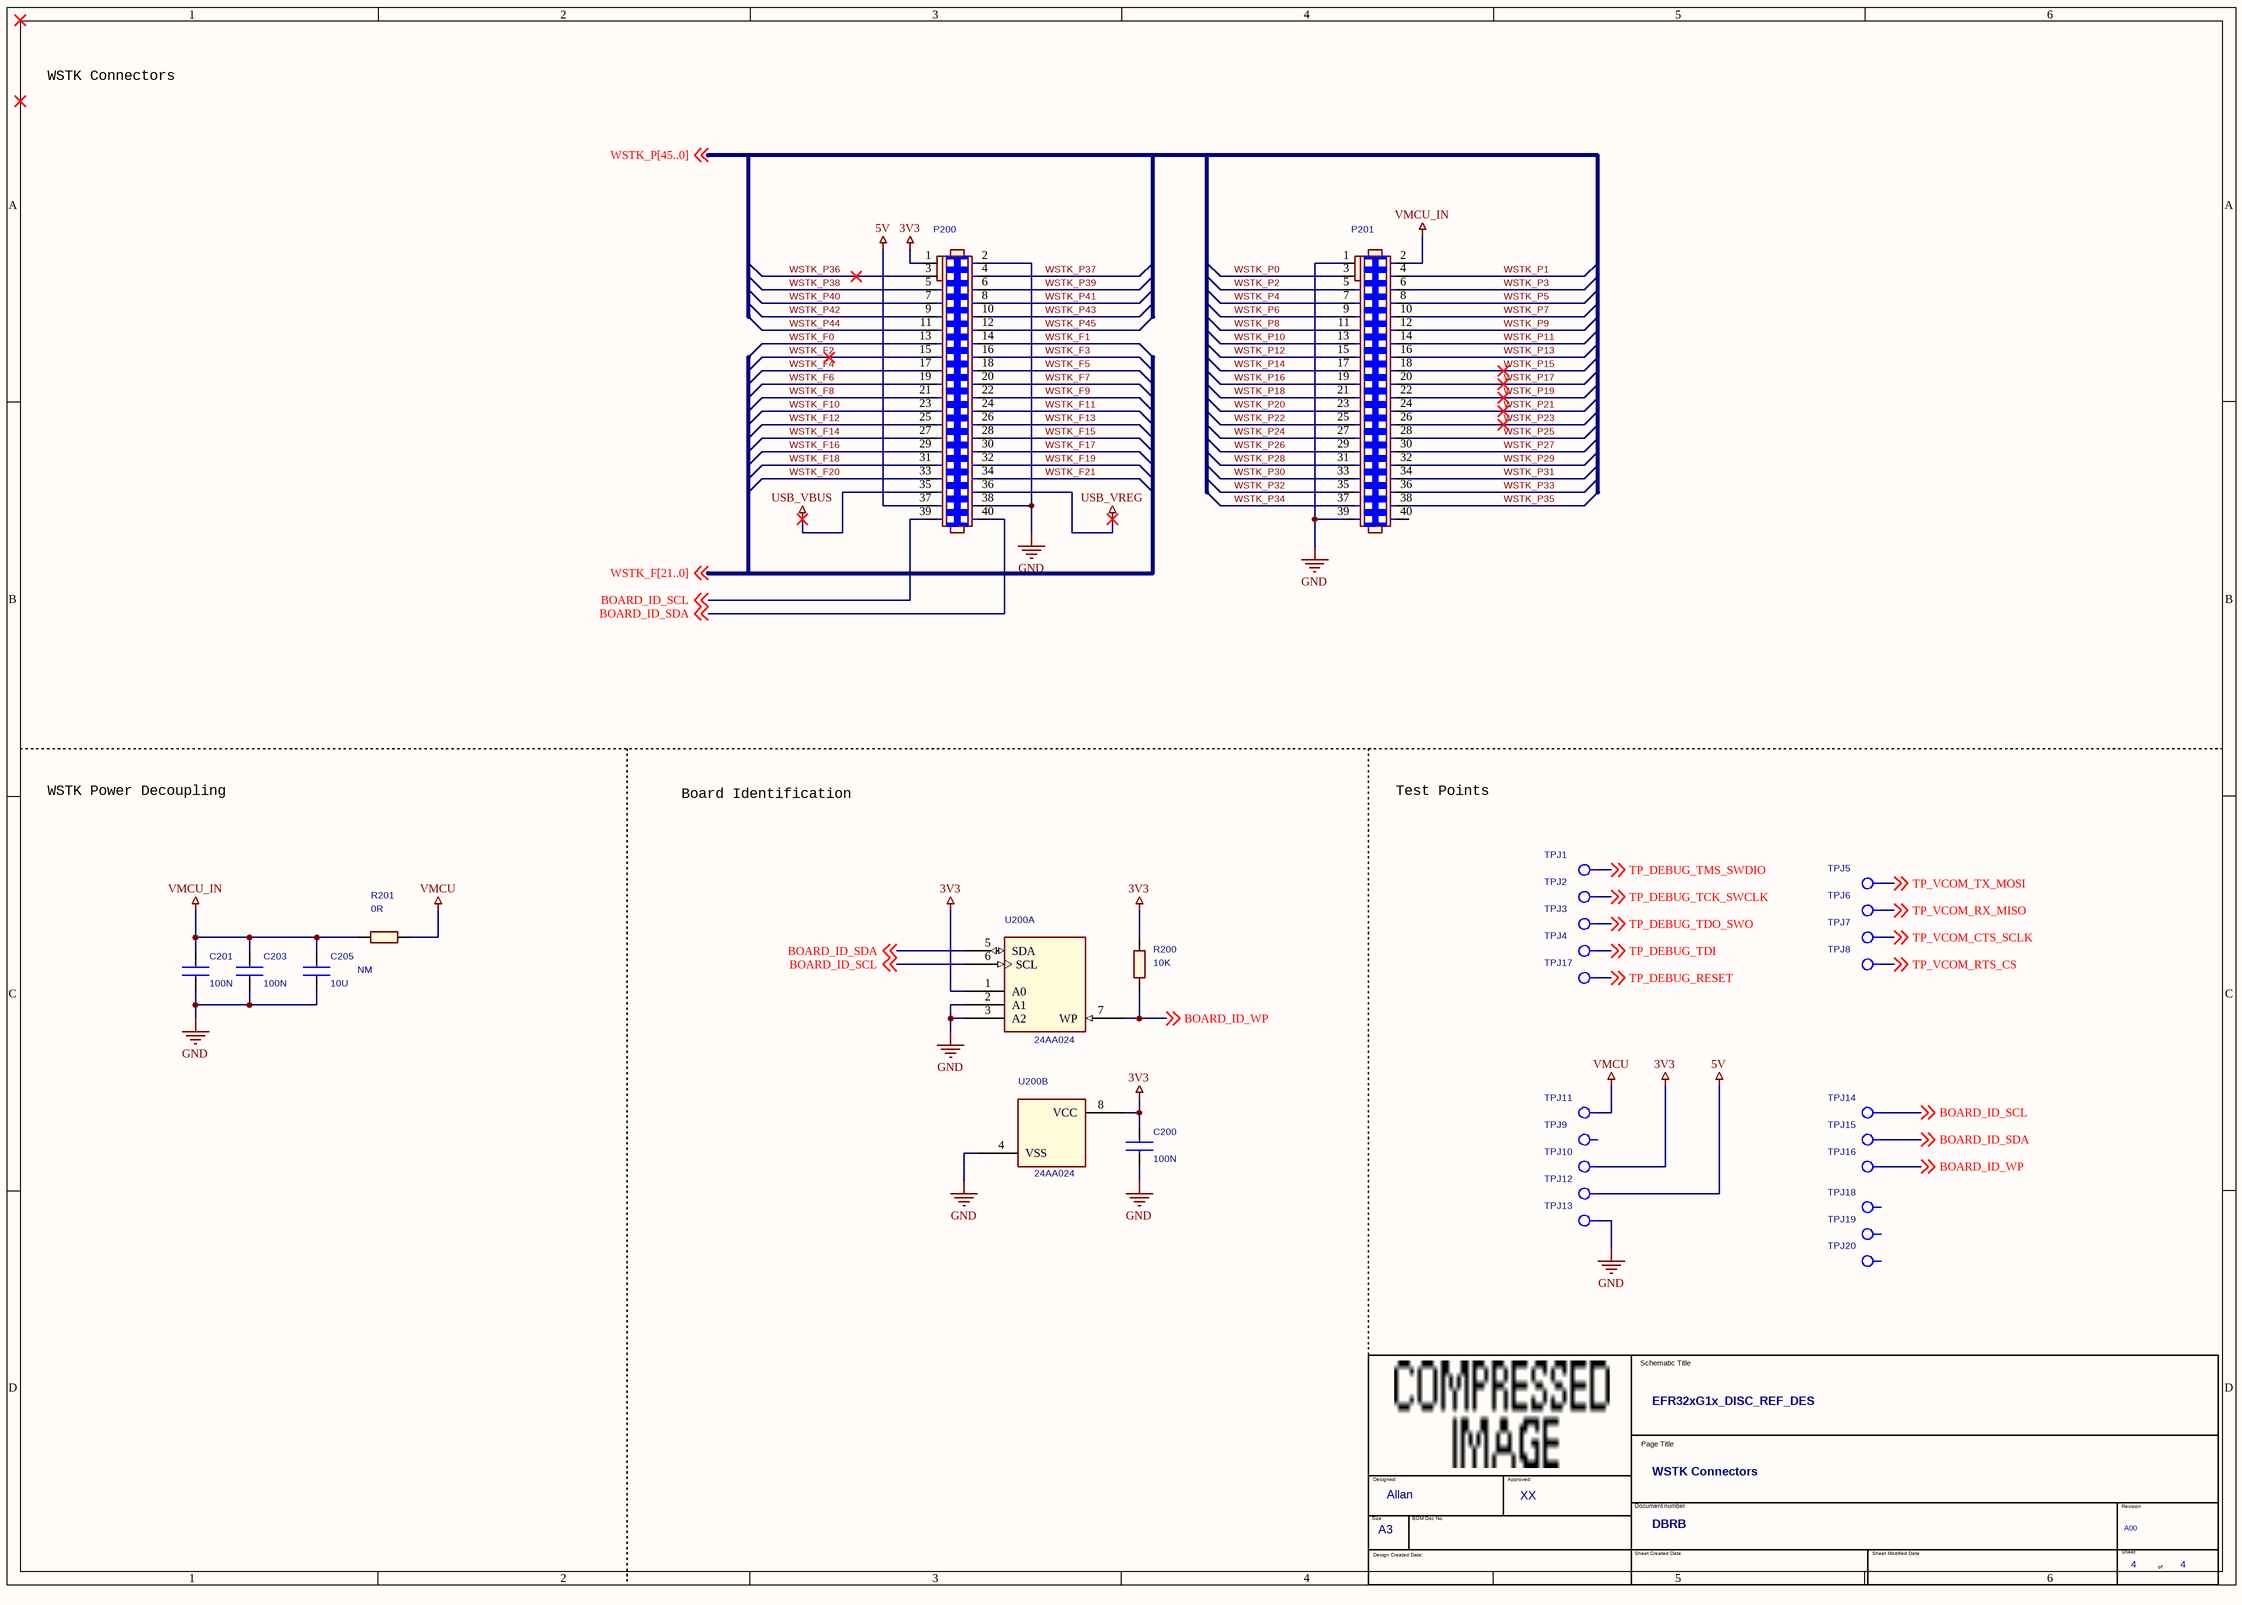
[diagram p4: 04_EFR32xG1x_DISC_REF_DES_A00_Conn.SchDoc]

### Parts
(Parts that share a designator on the sheet are numbered #1, #2 ... from top to bottom, then left to right.)
*#6  OrgAddr2: XX  OrgAddr1: Allan  Page Count: 4  Doc: DBRB  Title: EFR32xG1x_DISC_REF_DES  RevCode: A00  Page Size: A3  Page Title: WSTK Connectors  (hidden comment: TitleBlock_EnergyMicro_A3)  (graphical)
C200  100N  [C0402_L]
C201  100N  [C0402_L]
C203  100N  [C0402_L]
C205  10U  Not Mounted: NM  [C0805_L]
P200  SOCKET_2X20_1.27MM_SMD  [SAM_SFC-120-T2-D-A-2X20_SNUM]  (value not drawn)
P201  SOCKET_2X20_1.27MM_SMD  [SAM_SFC-120-T2-D-A-2X20_SNUM]  (value not drawn)
R200  10K  [R0402_L]
R201  0R  [R0402_L]
TPJ1  TPJ_SMD  [TP_1.0_SMD]  (value not drawn)
TPJ2  TPJ_SMD  [TP_1.0_SMD]  (value not drawn)
TPJ3  TPJ_SMD  [TP_1.0_SMD]  (value not drawn)
TPJ4  TPJ_SMD  [TP_1.0_SMD]  (value not drawn)
TPJ5  TPJ_SMD  [TP_1.0_SMD]  (value not drawn)
TPJ6  TPJ_SMD  [TP_1.0_SMD]  (value not drawn)
TPJ7  TPJ_SMD  [TP_1.0_SMD]  (value not drawn)
TPJ8  TPJ_SMD  [TP_1.0_SMD]  (value not drawn)
TPJ9  TPJ_SMD  [TP_1.0_SMD]  (value not drawn)
TPJ10  TPJ_SMD  [TP_1.0_SMD]  (value not drawn)
TPJ11  TPJ_SMD  [TP_1.0_SMD]  (value not drawn)
TPJ12  TPJ_SMD  [TP_1.0_SMD]  (value not drawn)
TPJ13  TPJ_SMD  [TP_1.0_SMD]  (value not drawn)
TPJ14  TPJ_SMD  [TP_1.0_SMD]  (value not drawn)
TPJ15  TPJ_SMD  [TP_1.0_SMD]  (value not drawn)
TPJ16  TPJ_SMD  [TP_1.0_SMD]  (value not drawn)
TPJ17  TPJ_SMD  [TP_1.0_SMD]  (value not drawn)
TPJ18  TPJ_SMD  [TP_1.0_SMD]  (value not drawn)
TPJ19  TPJ_SMD  [TP_1.0_SMD]  (value not drawn)
TPJ20  TPJ_SMD  [TP_1.0_SMD]  (value not drawn)
U200  24AA024  [TDFN8_M050_2.0X3.0_EP]  (parts A,B of 2)

### Nets
3V3: C200.1 P200.1 R200.2 TPJ10.1(TP) U200.1(A0) U200.8(VCC)
5V: P200.37 TPJ12.1(TP)
GND: C200.2 C201.2 C203.2 C205.2 P200.2 P200.38 P201.1 P201.39 TPJ13.1(TP) U200.2(A1) U200.3(A2) U200.4(VSS)
USB_VBUS: P200.35
USB_VREG: P200.36
VMCU: R201.2 TPJ11.1(TP)
VMCU_IN: C201.1 C203.1 C205.1 P201.2 R201.1
BOARD_ID_SCL: P200.39 TPJ14.1(TP) U200.6(SCL) ; off-sheet BOARD_ID_SCL
BOARD_ID_SDA: P200.40 TPJ15.1(TP) U200.5(SDA) ; off-sheet BOARD_ID_SDA
BOARD_ID_WP: R200.1 TPJ16.1(TP) U200.7(WP) ; off-sheet BOARD_ID_WP
TP_DEBUG_RESET: P200.17 TPJ17.1(TP) ; off-sheet TP_DEBUG_RESET  [also labelled WSTK_F4]  [project net DEBUG.RESET]
TP_DEBUG_TCK_SWCLK: P200.14 P201.27 TPJ2.1(TP) ; off-sheet TP_DEBUG_TCK_SWCLK  [also labelled WSTK_F1, WSTK_P24]  [project net DBG_SWCLK#0]
TP_DEBUG_TDI: P200.16 P201.13 TPJ4.1(TP) ; off-sheet TP_DEBUG_TDI  [also labelled WSTK_F3, WSTK_P10]  [project net DBG_TDI#0]
TP_DEBUG_TDO_SWO: P200.15 P201.31 TPJ3.1(TP) ; off-sheet TP_DEBUG_TDO_SWO  [also labelled WSTK_F2, WSTK_P28]  [project net DBG_SWO#0 / DBG_TDO#0]
TP_DEBUG_TMS_SWDIO: P200.13 P201.29 TPJ1.1(TP) ; off-sheet TP_DEBUG_TMS_SWDIO  [also labelled WSTK_F0, WSTK_P26]  [project net DBG_SWDIOTMS#0]
TP_VCOM_CTS_SCLK: P200.21 P201.3 TPJ7.1(TP) ; off-sheet TP_VCOM_CTS_SCLK  [also labelled WSTK_F8, WSTK_P0]  [project net EXP_HEADER3]
TP_VCOM_RTS_CS: P200.22 P201.5 TPJ8.1(TP) ; off-sheet TP_VCOM_RTS_CS  [also labelled WSTK_F9, WSTK_P2]  [project net EXP_HEADER5]
TP_VCOM_RX_MISO: P200.20 P201.14 TPJ6.1(TP) ; off-sheet TP_VCOM_RX_MISO  [also labelled WSTK_F7, WSTK_P11]  [project net EXP_HEADER14]
TP_VCOM_TX_MOSI: P200.19 P201.12 TPJ5.1(TP) ; off-sheet TP_VCOM_TX_MOSI  [also labelled WSTK_F6, WSTK_P9]  [project net EXP_HEADER12]
WSTK_F5: P200.18 P201.19  [also labelled WSTK_P16]  [project net RADIO_PA5]
WSTK_F10: P200.23 P201.11  [also labelled WSTK_P8]  [project net EXP_HEADER11]
WSTK_F11: P200.24 P201.35  [also labelled WSTK_P32]  [project net RADIO_PF5]
WSTK_F12: P200.25 P201.7  [also labelled WSTK_P4]  [project net EXP_HEADER7]
WSTK_F13: P200.26 P201.9  [also labelled WSTK_P6]  [project net EXP_HEADER9]
WSTK_F14: P200.27  [project net DISP_ENABLE]
WSTK_F15: P200.28 P201.8  [also labelled WSTK_P5]  [project net DISP_SCLK]
WSTK_F16: P200.29 P201.4  [also labelled WSTK_P1]  [project net DISP_SI]
WSTK_F17: P200.30 P201.36  [also labelled WSTK_P33]  [project net DISP_SCS]
WSTK_F18: P200.31 P201.34  [also labelled WSTK_P31]  [project net DISP_EXTCOMIN]
WSTK_F19: P200.32 P201.25  [also labelled WSTK_P22]  [project net FRC_DFRAME#6]
WSTK_F20: P200.33 P201.23  [also labelled WSTK_P20]  [project net FRC_DOUT#6]
WSTK_F21: P200.34 P201.21  [also labelled WSTK_P18]  [project net FRC_DCLK#6]
WSTK_P3: P201.6  [project net EXP_HEADER6]
WSTK_P7: P201.10  [project net EXP_HEADER10]
WSTK_P12: P201.15  [project net EXP_HEADER15]
WSTK_P13: P201.16  [project net EXP_HEADER16]
WSTK_P14: P201.17  [project net RADIO_PA4]
WSTK_P15: P201.18
WSTK_P17: P201.20
WSTK_P19: P201.22
WSTK_P21: P201.24
WSTK_P23: P201.26
WSTK_P25: P201.28
WSTK_P27: P201.30
WSTK_P29: P201.32
WSTK_P30: P201.33
WSTK_P34: P201.37
WSTK_P35: P201.38  [project net RADIO_PD15]
WSTK_P36: P200.3
WSTK_P37: P200.4  [project net SENSOR_ENABLE]
WSTK_P38: P200.5
WSTK_P39: P200.6
WSTK_P40: P200.7
WSTK_P41: P200.8
WSTK_P42: P200.9
WSTK_P43: P200.10
WSTK_P44: P200.11
WSTK_P45: P200.12

Not connected (* = marked no-connect by the designer): P201 40; TPJ9 1(TP); TPJ18 1(TP); TPJ19 1(TP); TPJ20 1(TP)

### Notes on the sheet
- WSTK Connectors
- WSTK Power Decoupling
- Board Identification
- Test Points
- (in symbol TitleBlock_EnergyMicro_A3) Schematic Title; Page Title; Designed:; Approved:; Document number; Revision; Size; BOM Doc No:; Design Created Date:; Sheet Created Date; Sheet Modified Date; Sheet; of

### Library data of the parts
C200 C201 C203 = C0402: Rating: 16V; Tolerance: 10%; Technology: X7R
C205 = C0805: Rating: 10V; Tolerance: 10%; Technology: X5R
P200 P201 = SOCKET_2X20_1.27MM_SMD: Mfg: Samtec; Mfg #: SFC-120-T2-L-D-A-K-TR; Price_1K: 3.44
R200 R201 = R0402: Price_1K: 0.005
U200 = 24AA024: Mfg #: 24AA024T-I/MNY; Mfg: Microchip; Price_1K: 0.22
*#6 = TitleBlock_EnergyMicro_A3: Page Number: 4

## Nets that join several sheets
GND: 02_EFR32xG1x_DISC_REF_DES_A00_RfAntPower (36 pins), 03_EFR32xG1x_DISC_REF_DES_A00_Efr32Signal (C124.2 C207.2 U100.B2), 04_EFR32xG1x_DISC_REF_DES_A00_Conn (12 pins)
VMCU: 02_EFR32xG1x_DISC_REF_DES_A00_RfAntPower (7 pins), 03_EFR32xG1x_DISC_REF_DES_A00_Efr32Signal (6 pins), 04_EFR32xG1x_DISC_REF_DES_A00_Conn (R201.2 TPJ11.1)
DBG_SWCLK#0: 03_EFR32xG1x_DISC_REF_DES_A00_Efr32Signal (U1.1), 04_EFR32xG1x_DISC_REF_DES_A00_Conn (P200.14 P201.27 TPJ2.1)
DBG_SWDIOTMS#0: 03_EFR32xG1x_DISC_REF_DES_A00_Efr32Signal (U1.2), 04_EFR32xG1x_DISC_REF_DES_A00_Conn (P200.13 P201.29 TPJ1.1)
DBG_SWO#0 / DBG_TDO#0: 03_EFR32xG1x_DISC_REF_DES_A00_Efr32Signal (U1.3), 04_EFR32xG1x_DISC_REF_DES_A00_Conn (P200.15 P201.31 TPJ3.1)
DBG_TDI#0: 03_EFR32xG1x_DISC_REF_DES_A00_Efr32Signal (U1.4), 04_EFR32xG1x_DISC_REF_DES_A00_Conn (P200.16 P201.13 TPJ4.1)
DEBUG.RESET: 02_EFR32xG1x_DISC_REF_DES_A00_RfAntPower (U1.12), 03_EFR32xG1x_DISC_REF_DES_A00_Efr32Signal (C207.1), 04_EFR32xG1x_DISC_REF_DES_A00_Conn (P200.17 TPJ17.1)
DISP_ENABLE: 03_EFR32xG1x_DISC_REF_DES_A00_Efr32Signal (R205.2 R206.2), 04_EFR32xG1x_DISC_REF_DES_A00_Conn (P200.27)
DISP_EXTCOMIN: 03_EFR32xG1x_DISC_REF_DES_A00_Efr32Signal (U1.22), 04_EFR32xG1x_DISC_REF_DES_A00_Conn (P200.31 P201.34)
DISP_SCLK: 03_EFR32xG1x_DISC_REF_DES_A00_Efr32Signal (RP200.6), 04_EFR32xG1x_DISC_REF_DES_A00_Conn (P200.28 P201.8)
DISP_SCS: 03_EFR32xG1x_DISC_REF_DES_A00_Efr32Signal (U1.23), 04_EFR32xG1x_DISC_REF_DES_A00_Conn (P200.30 P201.36)
DISP_SI: 03_EFR32xG1x_DISC_REF_DES_A00_Efr32Signal (RP200.7), 04_EFR32xG1x_DISC_REF_DES_A00_Conn (P200.29 P201.4)
EXP_HEADER3: 03_EFR32xG1x_DISC_REF_DES_A00_Efr32Signal (U1.27), 04_EFR32xG1x_DISC_REF_DES_A00_Conn (P200.21 P201.3 TPJ7.1)
EXP_HEADER5: 03_EFR32xG1x_DISC_REF_DES_A00_Efr32Signal (U1.28), 04_EFR32xG1x_DISC_REF_DES_A00_Conn (P200.22 P201.5 TPJ8.1)
EXP_HEADER6: 03_EFR32xG1x_DISC_REF_DES_A00_Efr32Signal (RP200.8), 04_EFR32xG1x_DISC_REF_DES_A00_Conn (P201.6)
EXP_HEADER7: 03_EFR32xG1x_DISC_REF_DES_A00_Efr32Signal (U1.7), 04_EFR32xG1x_DISC_REF_DES_A00_Conn (P200.25 P201.7)
EXP_HEADER9: 03_EFR32xG1x_DISC_REF_DES_A00_Efr32Signal (U1.8), 04_EFR32xG1x_DISC_REF_DES_A00_Conn (P200.26 P201.9)
EXP_HEADER10: 03_EFR32xG1x_DISC_REF_DES_A00_Efr32Signal (U1.46), 04_EFR32xG1x_DISC_REF_DES_A00_Conn (P201.10)
EXP_HEADER11: 03_EFR32xG1x_DISC_REF_DES_A00_Efr32Signal (U1.5), 04_EFR32xG1x_DISC_REF_DES_A00_Conn (P200.23 P201.11)
EXP_HEADER12: 03_EFR32xG1x_DISC_REF_DES_A00_Efr32Signal (U1.25), 04_EFR32xG1x_DISC_REF_DES_A00_Conn (P200.19 P201.12 TPJ5.1)
EXP_HEADER14: 03_EFR32xG1x_DISC_REF_DES_A00_Efr32Signal (U1.26), 04_EFR32xG1x_DISC_REF_DES_A00_Conn (P200.20 P201.14 TPJ6.1)
EXP_HEADER15: 03_EFR32xG1x_DISC_REF_DES_A00_Efr32Signal (U1.47), 04_EFR32xG1x_DISC_REF_DES_A00_Conn (P201.15)
EXP_HEADER16: 03_EFR32xG1x_DISC_REF_DES_A00_Efr32Signal (U1.48), 04_EFR32xG1x_DISC_REF_DES_A00_Conn (P201.16)
FRC_DCLK#6: 03_EFR32xG1x_DISC_REF_DES_A00_Efr32Signal (U1.31), 04_EFR32xG1x_DISC_REF_DES_A00_Conn (P200.34 P201.21)
FRC_DFRAME#6: 03_EFR32xG1x_DISC_REF_DES_A00_Efr32Signal (U1.33), 04_EFR32xG1x_DISC_REF_DES_A00_Conn (P200.32 P201.25)
FRC_DOUT#6: 03_EFR32xG1x_DISC_REF_DES_A00_Efr32Signal (U1.32), 04_EFR32xG1x_DISC_REF_DES_A00_Conn (P200.33 P201.23)
RADIO_PA4: 03_EFR32xG1x_DISC_REF_DES_A00_Efr32Signal (R103.2 U1.29 U100.A3), 04_EFR32xG1x_DISC_REF_DES_A00_Conn (P201.17)
RADIO_PA5: 03_EFR32xG1x_DISC_REF_DES_A00_Efr32Signal (U1.30), 04_EFR32xG1x_DISC_REF_DES_A00_Conn (P200.18 P201.19)
RADIO_PB14: 02_EFR32xG1x_DISC_REF_DES_A00_RfAntPower (X2.2), 03_EFR32xG1x_DISC_REF_DES_A00_Efr32Signal (U1.35)
RADIO_PB15: 02_EFR32xG1x_DISC_REF_DES_A00_RfAntPower (X2.1), 03_EFR32xG1x_DISC_REF_DES_A00_Efr32Signal (U1.36)
RADIO_PD15: 03_EFR32xG1x_DISC_REF_DES_A00_Efr32Signal (R203.1 R205.1 U1.24), 04_EFR32xG1x_DISC_REF_DES_A00_Conn (P201.38)
RADIO_PF5: 03_EFR32xG1x_DISC_REF_DES_A00_Efr32Signal (U1.6), 04_EFR32xG1x_DISC_REF_DES_A00_Conn (P200.24 P201.35)
SENSOR_ENABLE: 03_EFR32xG1x_DISC_REF_DES_A00_Efr32Signal (R203.2 R204.2), 04_EFR32xG1x_DISC_REF_DES_A00_Conn (P200.4)

## Assembly variants
Variant of EFR32xG1x_DISC_REF_DES_A00_434MHz: all parts fitted
Variant of EFR32xG1x_DISC_REF_DES_A00_490MHz: all parts fitted
Variant of EFR32xG1x_DISC_REF_DES_A00_868MHz: all parts fitted
Variant of EFR32xG1x_DISC_REF_DES_A00_915MHz: all parts fitted
Variant of EFR32xG1x_DISC_REF_DES_A00_868&915MHz compatible: all parts fitted